# Altium schematic sheet OneDigitSubcircuit.SchDoc
size A4
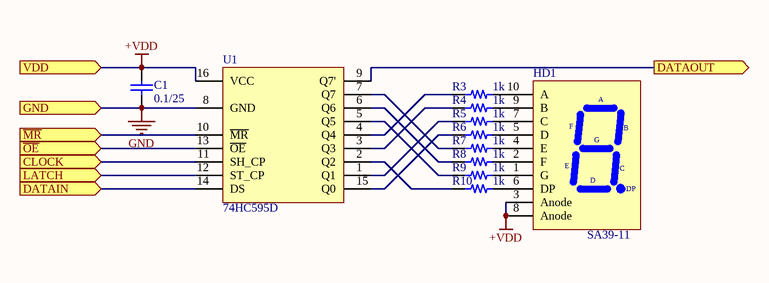
[diagram p0: OneDigitSubcircuit.SchDoc]

## Parts
C1  0.1/25  [CAP0603]
HD1  SA39-11  [39-11 7-segment]
R3  1k  [RES0402]
R4  1k  [RES0402]
R5  1k  [RES0402]
R6  1k  [RES0402]
R7  1k  [RES0402]
R8  1k  [RES0402]
R9  1k  [RES0402]
R10  1k  [RES0402]
U1  74HC595D  [SO16]

## Ports
CLOCK (in), DATAIN (in), DATAOUT (out), GND (in), LATCH (in), VDD (in), ~{MR} (in), ~{OE} (in)

## Nets
+VDD: C1.2 HD1.3(Anode) HD1.8(Anode) U1.16(VCC) ; port VDD
GND: C1.1 U1.8(GND) ; port GND
CLOCK: U1.11(SH_CP) ; port CLOCK
DATAIN: U1.14(DS) ; port DATAIN
DATAOUT: U1.9(Q7') ; port DATAOUT
LATCH: U1.12(ST_CP) ; port LATCH
~{MR}: U1.10(~{MR}) ; port ~{MR}
~{OE}: U1.13(~{OE}) ; port ~{OE}
NetHD1_1: HD1.1(G) R9.1
NetHD1_2: HD1.2(F) R8.1
NetHD1_4: HD1.4(E) R7.1
NetHD1_5: HD1.5(D) R6.1
NetHD1_6: HD1.6(DP) R10.1
NetHD1_7: HD1.7(C) R5.1
NetHD1_9: HD1.9(B) R4.1
NetHD1_10: HD1.10(A) R3.1
NetR3_2: R3.2 U1.4(Q4)
NetR4_2: R4.2 U1.3(Q3)
NetR5_2: R5.2 U1.1(Q1)
NetR6_2: R6.2 U1.15(Q0)
NetR7_2: R7.2 U1.7(Q7)
NetR8_2: R8.2 U1.6(Q6)
NetR9_2: R9.2 U1.5(Q5)
NetR10_2: R10.2 U1.2(Q2)

## Library data of the parts
C1 = CAP0603: Ceramic chip capacitor 0603; Value: 0.1; Voltage: 25; PartNumber: CAP0603; Category: Capacitor; Author: oiezhov
HD1 = SA39-11: 9.9mm (0.39INCH) Single Digit 7-Segment Numeric Display (Common Anode); PartNumber: SA39-11; Category: Optical; ComponentLink1Description: Datasheet; ComponentLink1URL: d:\_AltiumLibs\Pdf\Optical\SA39-11CGKWA.pdf; Author: oiezhov
R3-R10 = RES0402: Ceramic chip resistor; PartNumber: RES0402; Value: 1k; Category: Resistor; Author: oiezhov
U1 = 74HC595D: 8-bit serial-in, serial or parallel-out shift register with output latches; 3-state; PartNumber: 74HC595D; Category: IC/Logic; ComponentLink1Description: Datasheet; ComponentLink1URL: d:\_AltiumLibs\Pdf\IC\Logic\74HC_HCT595.pdf; Author: oiezhov